# Altium project iSystem.PrjPcb
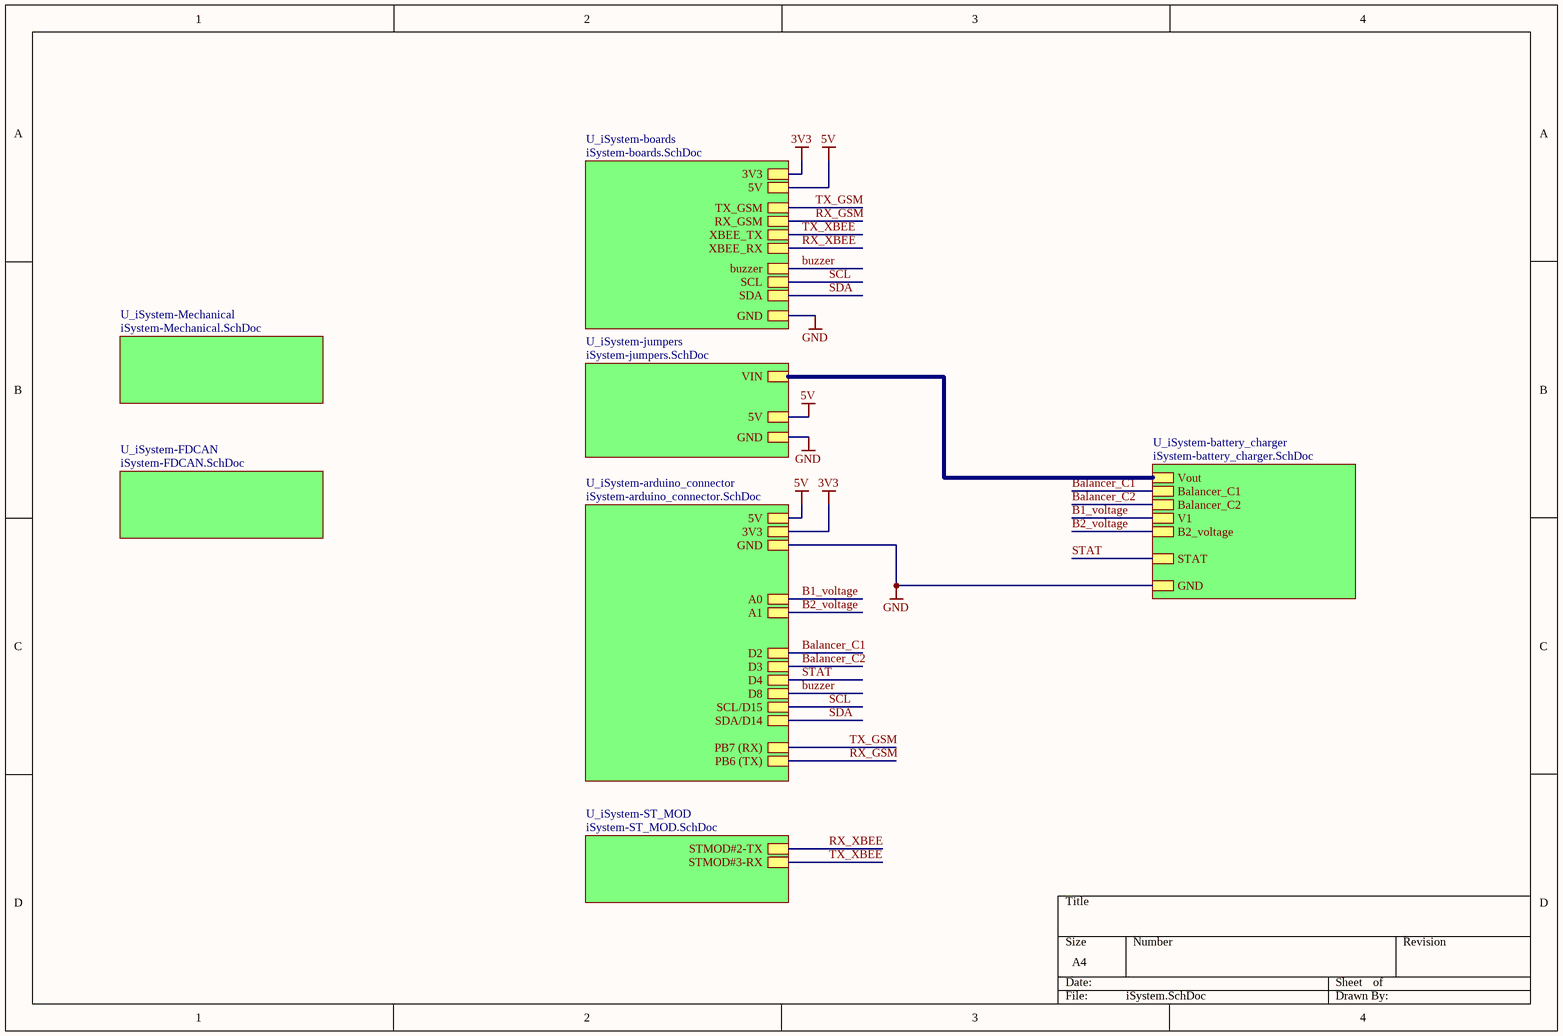
[diagram p0: iSystem.SchDoc]
8 sheets, 82 parts. Net scope: hierarchical (ports join the sheet entries above them; power ports are global).
Board file: iSystem.PcbDoc
Sheets:
  iSystem.SchDoc
    U_iSystem-Mechanical = iSystem-Mechanical.SchDoc
    U_iSystem-FDCAN = iSystem-FDCAN.SchDoc
    U_iSystem-boards = iSystem-boards.SchDoc
    U_iSystem-jumpers = iSystem-jumpers.SchDoc
    U_iSystem-arduino_connector = iSystem-arduino_connector.SchDoc
    U_iSystem-ST_MOD = iSystem-ST_MOD.SchDoc
    U_iSystem-battery_charger = iSystem-battery_charger.SchDoc

## Sheet iSystem.SchDoc
size A4; SheetNumber: 1; SheetTotal: 8

### Sub-sheets
U_iSystem-arduino_connector = iSystem-arduino_connector.SchDoc: 3V3, 5V, GND, A0, A1, PB7 (RX), PB6 (TX), D2, D3, D4, D8, SCL/D15, SDA/D14
U_iSystem-battery_charger = iSystem-battery_charger.SchDoc: Vout, Balancer_C1, Balancer_C2, V1, GND, STAT, B2_voltage
U_iSystem-boards = iSystem-boards.SchDoc: 3V3, 5V, GND, TX_GSM, RX_GSM, buzzer, XBEE_TX, XBEE_RX, SCL, SDA
U_iSystem-FDCAN = iSystem-FDCAN.SchDoc: no entries
U_iSystem-jumpers = iSystem-jumpers.SchDoc: 5V, GND, VIN
U_iSystem-Mechanical = iSystem-Mechanical.SchDoc: no entries
U_iSystem-ST_MOD = iSystem-ST_MOD.SchDoc: STMOD#2-TX, STMOD#3-RX

### Nets
3V3: sheet U_iSystem-boards/3V3, sheet U_iSystem-arduino_connector/3V3
5V: sheet U_iSystem-boards/5V, sheet U_iSystem-jumpers/5V, sheet U_iSystem-arduino_connector/5V
GND: sheet U_iSystem-boards/GND, sheet U_iSystem-jumpers/GND, sheet U_iSystem-arduino_connector/GND, sheet U_iSystem-battery_charger/GND
B1_voltage: sheet U_iSystem-arduino_connector/A0, sheet U_iSystem-battery_charger/V1
B2_voltage: sheet U_iSystem-arduino_connector/A1, sheet U_iSystem-battery_charger/B2_voltage
Balancer_C1: sheet U_iSystem-arduino_connector/D2, sheet U_iSystem-battery_charger/Balancer_C1
Balancer_C2: sheet U_iSystem-arduino_connector/D3, sheet U_iSystem-battery_charger/Balancer_C2
BAT1+: sheet U_iSystem-jumpers/VIN, sheet U_iSystem-battery_charger/Vout
buzzer: sheet U_iSystem-boards/buzzer, sheet U_iSystem-arduino_connector/D8
RX_GSM: sheet U_iSystem-boards/RX_GSM, sheet U_iSystem-arduino_connector/PB6 (TX)
RX_XBEE: sheet U_iSystem-boards/XBEE_RX, sheet U_iSystem-ST_MOD/STMOD#2-TX
SCL: sheet U_iSystem-boards/SCL, sheet U_iSystem-arduino_connector/SCL/D15
SDA: sheet U_iSystem-boards/SDA, sheet U_iSystem-arduino_connector/SDA/D14
STAT: sheet U_iSystem-arduino_connector/D4, sheet U_iSystem-battery_charger/STAT
TX_GSM: sheet U_iSystem-boards/TX_GSM, sheet U_iSystem-arduino_connector/PB7 (RX)
TX_XBEE: sheet U_iSystem-boards/XBEE_TX, sheet U_iSystem-ST_MOD/STMOD#3-RX

## Sheet iSystem-Mechanical.SchDoc
size A4; SheetNumber: 8; SheetTotal: 8
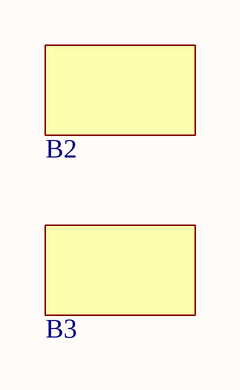
[diagram p1: iSystem-Mechanical.SchDoc]

### Parts
B2  BAT  [BAT]  (value not drawn)
B3  BAT  [BAT]  (value not drawn)

## Sheet iSystem-FDCAN.SchDoc
size A4; SheetNumber: 6; SheetTotal: 8
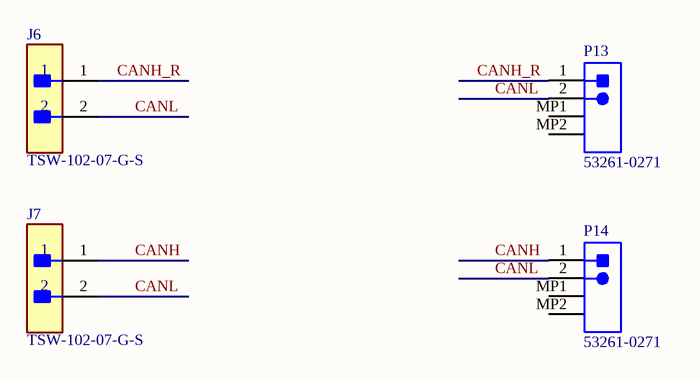
[diagram p2: iSystem-FDCAN.SchDoc]

### Parts
J6  TSW-102-07-G-S  [FP-TSW-102-07-G-S-MFG]
J7  TSW-102-07-G-S  [FP-TSW-102-07-G-S-MFG]
P13  53261-0271  [MOLX-53261-0271_V]
P14  53261-0271  [MOLX-53261-0271_V]

### Nets
CANH: J7.1 P14.1
CANH_R: J6.1 P13.1
CANL: J6.2 J7.2 P13.2 P14.2

Not connected (* = marked no-connect by the designer): P13 MP1 MP2; P14 MP1 MP2

### Library data of the parts
J6 J7 = CMP-02766-000084-1: CONN HEADER VERT 2POS 2.54MM; Manufacturer: Samtec; Number Of Contacts: 2; Voltage Rating: 550V; Conn Orientation: Straight; Current Rating: 6.3A; Conn Gender: Male; Package: TSW-102-07-G-S; Digikey Description: CONN HEADER VERT 2POS 2.54MM; ComponentLink2URL: http://suddendocs.samtec.com/catalog_english/tsw_th.pdf; Height: 8.71mm; Temperature: -55°C to +125°C; Device Class L2: Headers and Wire Housings; ComponentLink2Description: Datasheet; Device Class L3: unset; Contact Material: Gold,Nickel; Temperature Range Low: -55°C; Temperature Range High: +125°C; RoHS: TRUE; Device Class L1: Connectors; Mouser Description: Conn Unshrouded Header HDR 2 POS 2.54mm Solder ST Thru-Hole Automotive Bulk; Number Of Rows: 1; Category: Conn; Pitch: 2.54mm; Lead Free: Yes; Automotive: No; Manufacturer Part Number: TSW-102-07-G-S; Footprint Url: http://suddendocs.samtec.com/prints/tsw-xxx-xx-x-x-xx-xxx-footprint.pdf; Octopart: https://octopart.com/tsw-102-07-g-s-samtec-272197
P13 P14 = CMP-2000-05633-1: PicoBlade(TM) Header, Right Angle, -40 to 85 degC, 2-Pin SMD, RoHS, Tape and Reel; Current - Max: 1A; Brand: Molex; Voltage Rating: 125V; Number of Positions: 2; Pitch: 1.25mm; Package Version: Rev. H, 11/2014; Factory Pack Quantity: 1000; Datasheet URL: http://www.molex.com/webdocs/datasheets/pdf/en-us/0532610271_PCB_HEADERS.pdf; Datasheet Version: 03/2016; Housing Material: Thermoplastic; RoHS: Details; Product Type: Headers; Number of Rows: 1; Termination Style: SMD; Mounting Technology: SurfaceMount; Number of Positions / Contacts: 2; Package URL: http://www.molex.com/pdm_docs/sd/532610271_sd.pdf; Mounting Angle: Right; Mounting Style: SMD/SMT; Manufacturer: Molex; Product Category: 1.25mmConnectors; Tradename: PicoBlade; Voltage - Max: 125V; Manufacturer URL: http://www.molex.com/; Series: 53261; Package Description: 2-Leads Header, Pitch 1.25 mm, Mated Height 3.4 mm; Package Reference: 53261-0271; Current Rating: 1A; Contact Plating: Tin; Contact Material: PhosphorBronze; Type: Shrouded; Packaging: Reel

## Sheet iSystem-boards.SchDoc
size A4; SheetNumber: 7; SheetTotal: 8
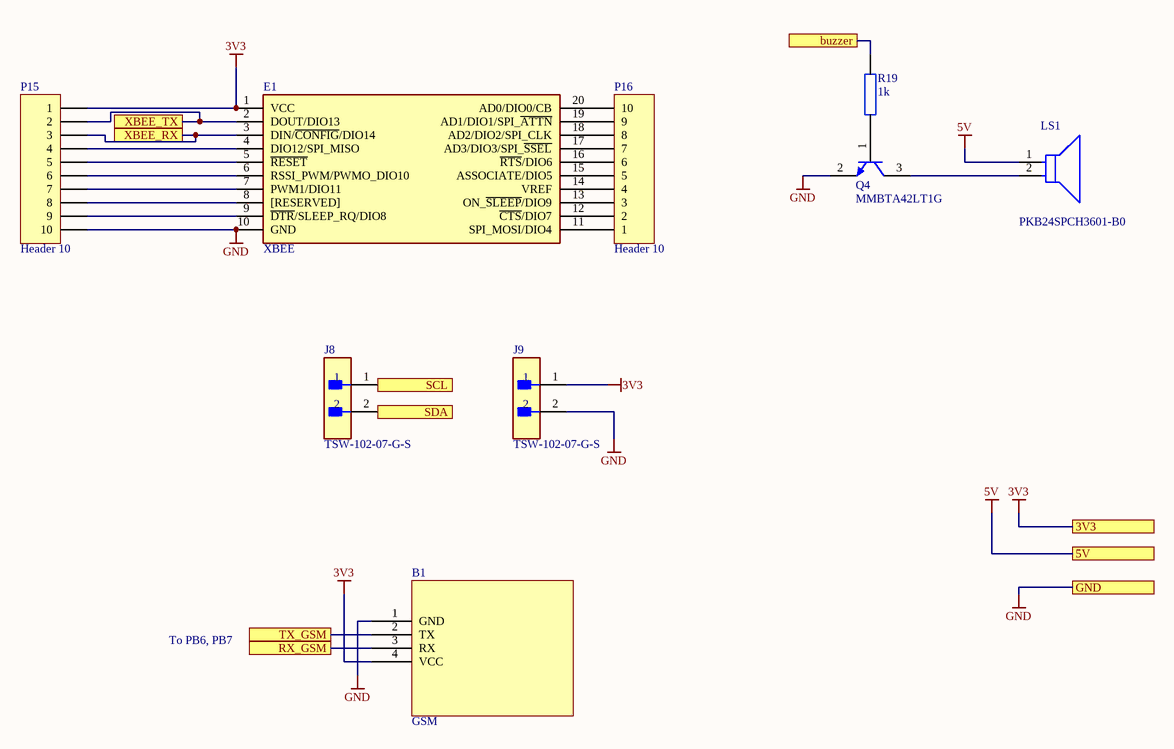
[diagram p3: iSystem-boards.SchDoc]

### Parts
B1  GSM  [GSM]
E1  XBEE  [XBEE]
J8  TSW-102-07-G-S  [FP-TSW-102-07-G-S-MFG]
J9  TSW-102-07-G-S  [FP-TSW-102-07-G-S-MFG]
LS1  PKB24SPCH3601-B0  [FP-PKB24SPCH3601-B0-MFG]
P15  Header 10  [HDR1X10]
P16  Header 10  [HDR1X10]
Q4  MMBTA42LT1G  [ONSC-SOT-23-3-318-08_V]
R19  1k  [0603]

### Ports
3V3, 5V, buzzer, GND, RX_GSM, SCL, SDA, TX_GSM, XBEE_RX, XBEE_TX

### Nets
3V3: B1.4(VCC) E1.1(VCC) J9.1 P15.1 ; port 3V3
5V: LS1.1(C) ; port 5V
GND: B1.1(GND) E1.10(GND) J9.2 P15.10 Q4.2(E) ; port GND
buzzer: R19.2 ; port buzzer
RX_GSM: B1.3(RX) ; port RX_GSM
RX_XBEE: E1.3(DIN/~{CONFIG}/DIO14) P15.3 ; port XBEE_RX
SCL: J8.1 ; port SCL
SDA: J8.2 ; port SDA
TX_GSM: B1.2(TX) ; port TX_GSM
TX_XBEE: E1.2(DOUT/DIO13) P15.2 ; port XBEE_TX
NetE1_4: E1.4(DIO12/SPI_MISO) P15.4
NetE1_5: E1.5(~{RESET}) P15.5
NetE1_6: E1.6(RSSI_PWM/PWMO_DIO10) P15.6
NetE1_7: E1.7(PWM1/DIO11) P15.7
NetE1_8: E1.8([RESERVED]) P15.8
NetE1_9: E1.9(~{DTR}/SLEEP_RQ/DIO8) P15.9
NetE1_11: E1.11(SPI_MOSI/DIO4) P16.1
NetE1_12: E1.12(~{CTS}/DIO7) P16.2
NetE1_13: E1.13(ON_~{SLEEP}/DIO9) P16.3
NetE1_14: E1.14(VREF) P16.4
NetE1_15: E1.15(ASSOCIATE/DIO5) P16.5
NetE1_16: E1.16(~{RTS}/DIO6) P16.6
NetE1_17: E1.17(AD3/DIO3/SPI_~{SSEL}) P16.7
NetE1_18: E1.18(AD2/DIO2/SPI_CLK) P16.8
NetE1_19: E1.19(AD1/DIO1/SPI_~{ATTN}) P16.9
NetE1_20: E1.20(AD0/DIO0/CB) P16.10
NetLS1_2: LS1.2(A) Q4.3(C)
NetQ4_1: Q4.1(B) R19.1

### Notes on the sheet
- To PB6, PB7

### Library data of the parts
B1 = GSM: 3V3
J8 J9 = CMP-02766-000084-1: as J6 on sheet iSystem-FDCAN; Package: TSW-102-07-G-S; Digikey Description: CONN HEADER VERT 2POS 2.54MM; ComponentLink2URL: http://suddendocs.samtec.com/catalog_english/tsw_th.pdf; Height: 8.71mm; Temperature: -55°C to +125°C; Device Class L2: Headers and Wire Housings; ComponentLink2Description: Datasheet; Device Class L3: unset; Contact Material: Gold,Nickel; Temperature Range Low: -55°C; Temperature Range High: +125°C; RoHS: TRUE; Device Class L1: Connectors; Mouser Description: Conn Unshrouded Header HDR 2 POS 2.54mm Solder ST Thru-Hole Automotive Bulk; Number Of Rows: 1; Category: Conn; Pitch: 2.54mm; Lead Free: Yes; Automotive: No; Manufacturer Part Number: TSW-102-07-G-S; Footprint Url: http://suddendocs.samtec.com/prints/tsw-xxx-xx-x-x-xx-xxx-footprint.pdf; Octopart: https://octopart.com/tsw-102-07-g-s-samtec-272197
LS1 = CMP-06203-000001-2: AUDIO PIEZO TRANSDUCER 3-15V TH; Self Resonant Frequency: 3.6kHz; Voltage Rating (DC): 15V; Min Supply Voltage: 3V; Operating Supply Current: 16mA; Voltage Rating: 12V; Max Frequency: 4.1kHz; Washable: No; REACH SVHC: No SVHC; Packaging: Bulk; Frequency: 3.6kHz; Max Operating Temperature: 70°C; Max Supply Voltage: 15V; Max Supply Voltage (DC): 15V; Diameter: 24.3mm; Lead Free: Lead Free; Radiation Hardening: No; Nominal Supply Current: 16mA; Height: 9.7mm; Mount: Flush; Nominal Supply Voltage (DC): 12V; Min Operating Temperature: -20°C; Termination: PC Pins; Length: 24.3mm; Package Quantity: 650; Min Supply Voltage (DC): 3V; Max Supply Current: 16mA
P15 P16 = Header 10: Header, 10-Pin; LatestRevisionDate: 17-Jul-2002; LatestRevisionNote: Re-released for DXP Platform.; Publisher: Altium Limited
Q4 = CMP-1048-00662-1: High Voltage Transistor, NPN Silicon, 3-Pin SOT-23, Pb-Free, Tape and Reel; Manufacturer: On Semiconductor; fT Min (MHz): 50; IC Continuous (A): 0.5; ComponentLink1URL: http://www.onsemi.com/; ComponentLink3URL: http://www.onsemi.cn/pub_link/Collateral/318-08.PDF; RoHS: TRUE; ComponentLink2Description: Datasheet; PartNumber: MMBTA42LT1G; Polarity: NPN; DatasheetVersion: Rev. 12; PackageReference: SOT-23-3-318-08; PackageDescription: 3-Pin Small Outline Transistor, Body 2.92 x 1.3 mm, Pitch 0.95 mm; ComponentLink3Description: Package Specification; ComponentLink1Description: Manufacturer URL; Packing: Tape and Reel; PackageVersion: Rev. AP, 11/2009; Mounting Technology: Surface Mount; ComponentLink2URL: http://www.onsemi.cn/pub_link/Collateral/MMBTA42LT1-D.PDF
R19 = Resistor: Value: ?

## Sheet iSystem-jumpers.SchDoc
size A4; SheetNumber: 3; SheetTotal: 8
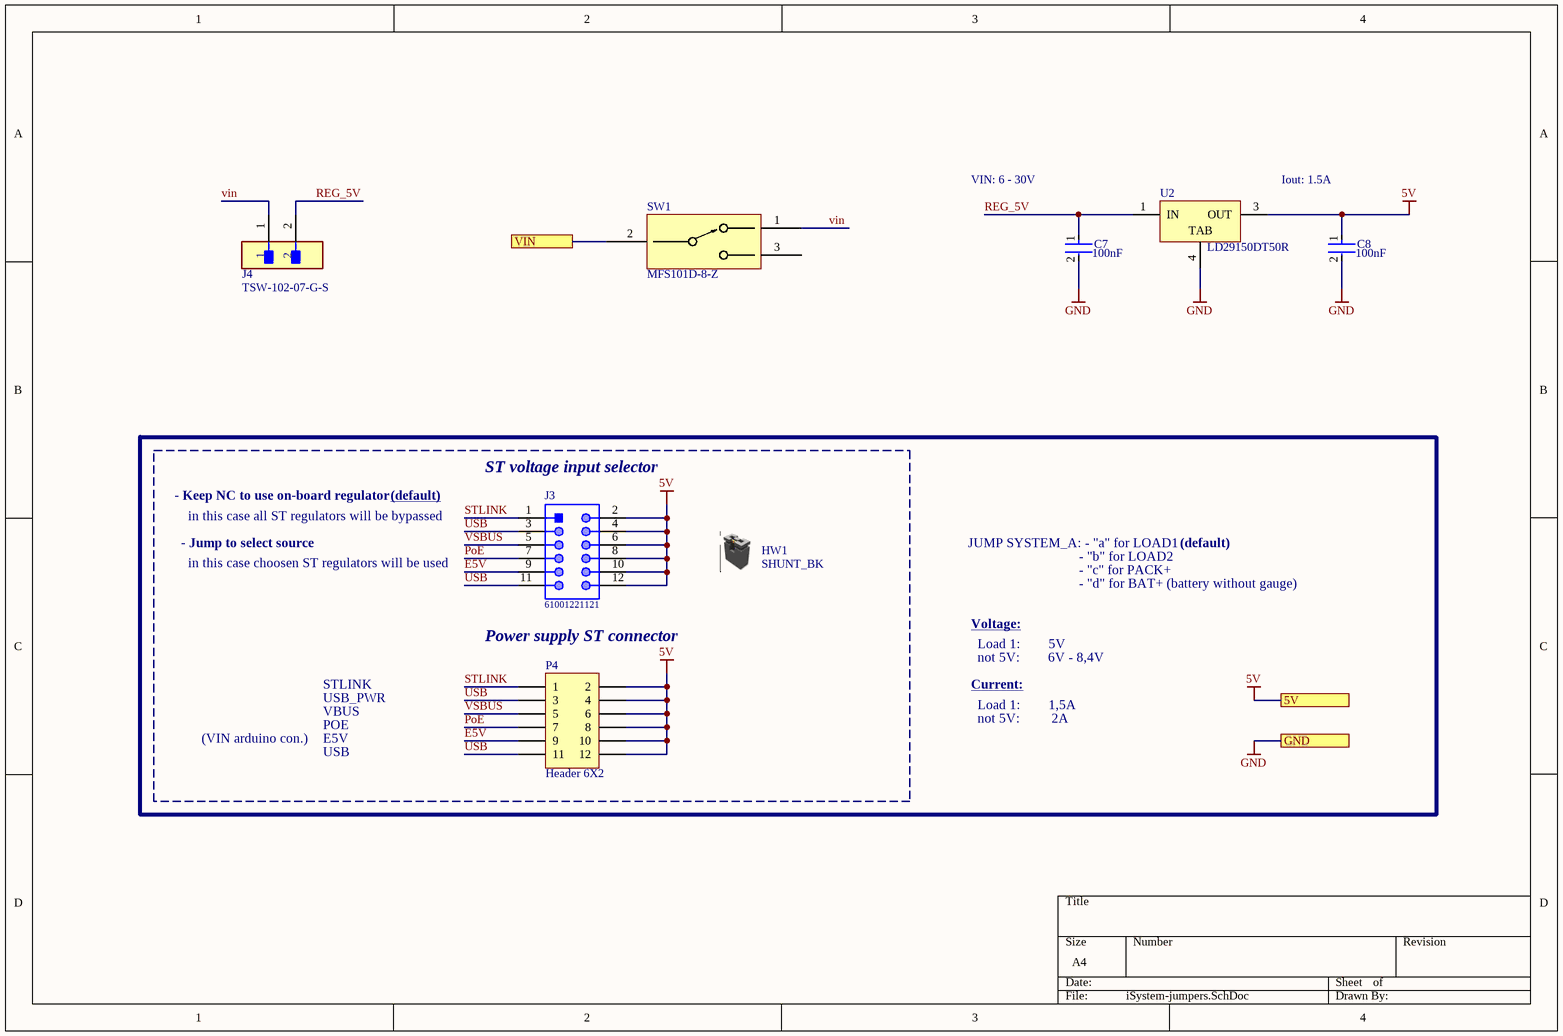
[diagram p4: iSystem-jumpers.SchDoc]

### Parts
C7  100nF  [FP-CGA3E-0_3-0_1-IPC_A]
C8  100nF  [FP-CGA3E-0_3-0_1-IPC_A]
HW1  value SHUNT_BK  [NA]  (hidden comment: Shunt Black 2.54mm)  (mechanical)
J3  61001221121  [61001221121]
J4  TSW-102-07-G-S  [FP-TSW-102-07-G-S-MFG]
P4  Header 6X2  [HDR2X6]
SW1  MFS101D-8-Z  [MFS101D-8-Z]
U2  LD29150DT50R  [TO-252_M]

### Ports
5V, GND, VIN

### Nets
5V: C8.1 J3.2 J3.4 J3.6 J3.8 J3.10 J3.12 P4.2 P4.4 P4.6 P4.8 P4.10 P4.12 U2.3(OUT) ; port 5V
GND: C7.2 C8.2 U2.4(TAB) ; port GND
BAT1+: SW1.2 ; port VIN
E5V: J3.9 P4.9
PoE: J3.7 P4.7
REG_5V: C7.1 J4.2 U2.1(IN)
STLINK: J3.1 P4.1
USB: J3.3 J3.11 P4.3 P4.11
vin: J4.1 SW1.1
VSBUS: J3.5 P4.5

Not connected (* = marked no-connect by the designer): SW1 3

### Notes on the sheet
- VIN: 6 - 30V
- Iout: 1.5A
- - Keep NC to use on-board regulator
- (near J3) in this case all ST regulators will be bypassed
- (default)
- ST voltage input selector
- - Jump to select source
- (near J3) in this case choosen ST regulators will be used
- JUMP SYSTEM_A: - "a" for LOAD1
- - "b" for LOAD2
- - "c" for PACK+
- Power supply ST connector
- Voltage:
- Load 1:        5V
- - "d" for BAT+ (battery without gauge)
- STLINK
- USB_PWR
- VBUS
- Current:
- not 5V:        6V - 8,4V
- Load 1:        1,5A
- (VIN arduino con.)
- POE
- E5V
- USB
- not 5V:         2A

### Library data of the parts
C7 C8 = CMP-2000-07546-2: Cap Ceramic 100nF 50V X7R 10% Pad SMD 0603 +125°C Automotive T/R; Weight: 7.1E-05oz; Composition: Ceramic; Max Operating Temperature: 125°C; Termination: SMD/SMT; Dielectric: X7R; Length: 1.6mm; Package Quantity: 1; REACH SVHC: No SVHC; Lead Free: Lead Free; Case Code (Metric): 1608; Min Operating Temperature: -55°C; Packaging: Tape and Reel; Tolerance: 10%; Voltage Rating: 50V; Case Code (Imperial): 0603; Capacitance: 100nF; Case/Package: 0603; Voltage Rating (DC): 50V; Depth: 0.8mm; Radiation Hardening: No; Ratings: AEC-Q200; Mount: Surface Mount; Voltage: 50V; Thickness: 0.035inch; Width: 0.8mm; Height: 0.8mm
HW1 = MCD-00122: SHUNT, 2.54mm, height 6.10mm, BLACK; Manufacturer_Part_Number: SNT-100-BK-G; Manufacturer: SAMTEC; Part_Type: Connector; ECCN_US: EAR99; ECCN_EU: NEC; Provided_By: Subcon; Initial_Board_Reference: mb1262; Internal_Part_Number: MCD-00122; Status: Released; ComponentLink1Description: Samtec_Shunt_Jumper_SNT100.pdf; ComponentLink1URL: http://tunmcdsvn.tun.st.com/Component_Datasheet_Library/Trunk/Connectors/Samtec_Shunt_Jumper_SNT100.pdf
J3 = CMP-1502-01029-1: SMT Vertical Pin Header WR-PHD, Pitch 2.54 mm, Dual Row, 12 pins; Manufacturer: Wurth Elektronik; Working Voltage: 250VAC; Pin Number: 12; Withstanding Voltage: 500VAC; Contact Resistance: 20mOhm; Rated Current: 3A; Gender: Male; Pitch: 2.54mm; Publisher: WurthElektronik; Packaging: Tube; Part Number: 61001221121; Row Number: Dual; Mounting Technology: SMT; Manufacturer URL: http://www.we-online.de; Operating Temperature: -40to125degC; Datasheet URL: https://katalog.we-online.de/em/datasheet/6100xx21121.pdf; Orientation: Vertical; Package Reference: 61001221121
J4 = CMP-02766-000084-1: as J6 on sheet iSystem-FDCAN; Package: TSW-102-07-G-S; Digikey Description: CONN HEADER VERT 2POS 2.54MM; ComponentLink2URL: http://suddendocs.samtec.com/catalog_english/tsw_th.pdf; Height: 8.71mm; Temperature: -55°C to +125°C; Device Class L2: Headers and Wire Housings; ComponentLink2Description: Datasheet; Device Class L3: unset; Contact Material: Gold,Nickel; Temperature Range Low: -55°C; Temperature Range High: +125°C; RoHS: TRUE; Device Class L1: Connectors; Mouser Description: Conn Unshrouded Header HDR 2 POS 2.54mm Solder ST Thru-Hole Automotive Bulk; Number Of Rows: 1; Category: Conn; Pitch: 2.54mm; Lead Free: Yes; Automotive: No; Manufacturer Part Number: TSW-102-07-G-S; Footprint Url: http://suddendocs.samtec.com/prints/tsw-xxx-xx-x-x-xx-xxx-footprint.pdf; Octopart: https://octopart.com/tsw-102-07-g-s-samtec-272197
P4 = Header 6X2: Header, 6-Pin, Dual row; LatestRevisionDate: 17-Jul-2002; LatestRevisionNote: Re-released for DXP Platform.; Publisher: Altium Limited
U2 = CMP-0244-00134-1: 1.5A, Very-Low Drop Voltage Regulator, 5V, 3-Pin DPAK; PackageDescription: 3-Pin Transistor Outline Package 2.28 mm Pitch, 9.7 mm Lead Span (DPAK); ComponentLink1URL: http://www.st.com; PackageVersion: 2011; ComponentLink1Description: Manufacturer URL; DatasheetVersion: 27/10/2010; ComponentLink2URL: http://www.st.com/internet/com/TECHNICAL_RESOURCES/TECHNICAL_LITERATURE/DATASHEET/CD00003403.pdf; PackageReference: TO-252; ComponentLink2Description: Datasheet

## Sheet iSystem-arduino_connector.SchDoc
size A4; SheetNumber: 4; SheetTotal: 8
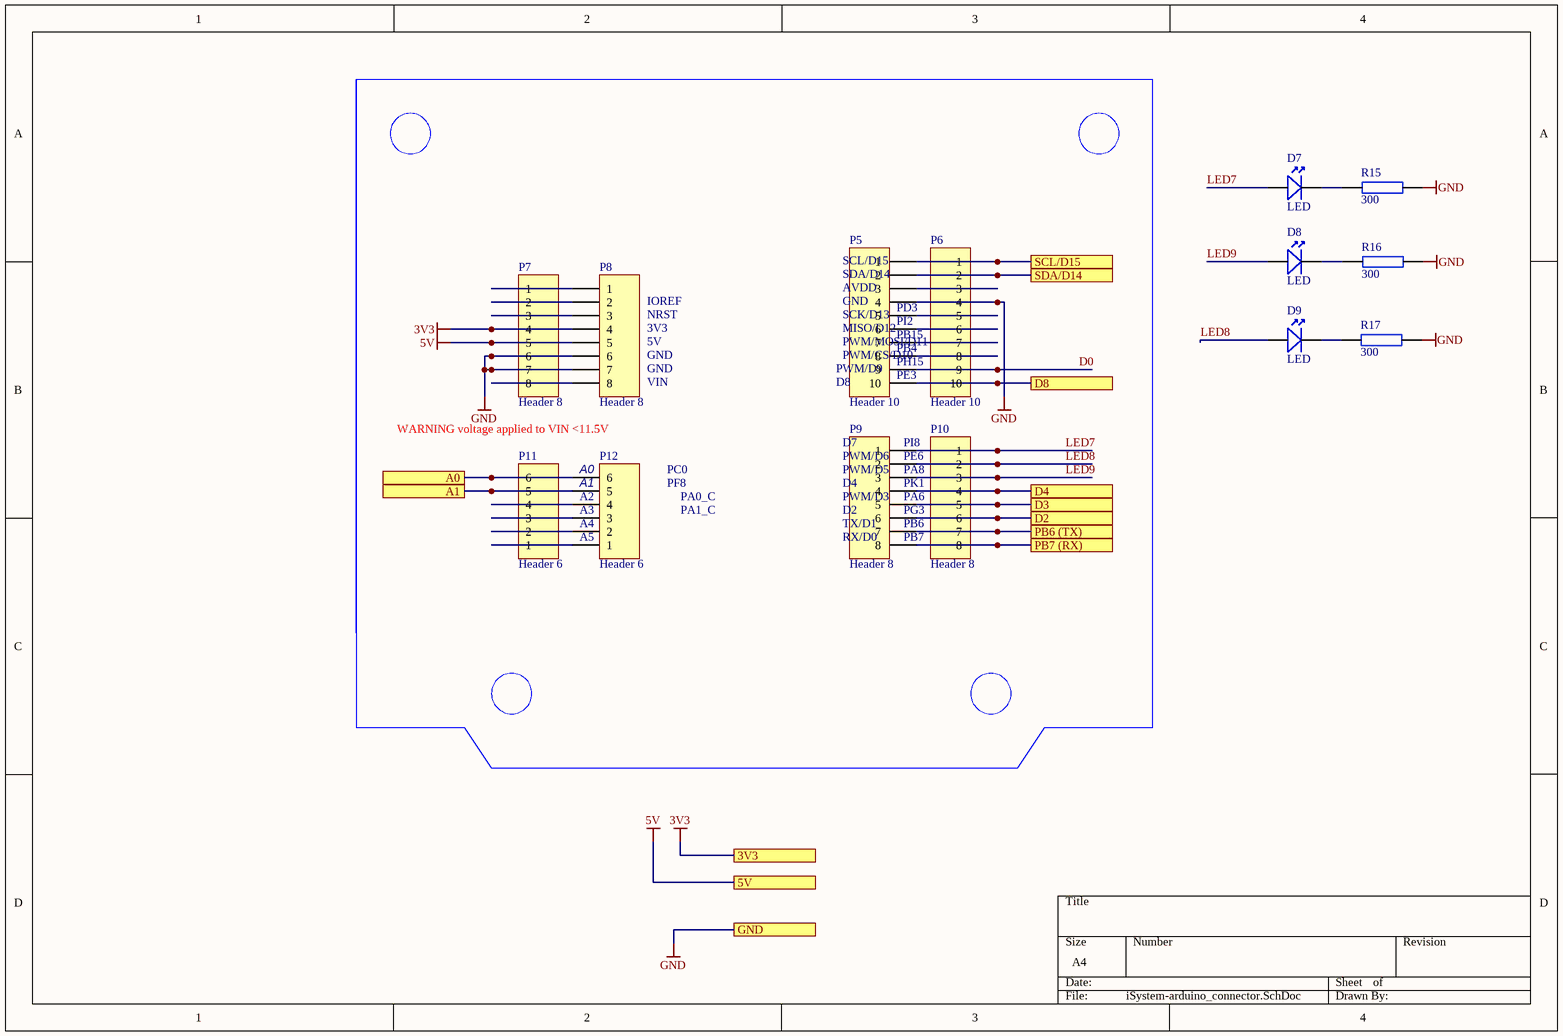
[diagram p5: iSystem-arduino_connector.SchDoc]

### Parts
D7  LED  [0805 LED RED]
D8  LED  [0805 LED RED]
D9  LED  [0805 LED RED]
P5  Header 10  [HDR1X10]
P6  Header 10  [HDR1X10]
P7  Header 8  [HDR1X8]
P8  Header 8  [HDR1X8]
P9  Header 8  [HDR1X8]
P10  Header 8  [HDR1X8]
P11  Header 6  [HDR1X6]
P12  Header 6  [HDR1X6]
R15  300  [0603]
R16  300  [0603]
R17  300  [0603]

### Ports
3V3, 5V, A0, A1, D2, D3, D4, D8, GND, PB6 (TX), PB7 (RX), SCL/D15, SDA/D14

### Nets
3V3: P7.4 P8.4 ; port 3V3
5V: P7.5 P8.5 ; port 5V
GND: P5.4 P6.4 P7.6 P7.7 P8.6 P8.7 R15.1 R16.1 R17.1 ; port GND
B1_voltage: P11.6 P12.6 ; port A0
B2_voltage: P11.5 P12.5 ; port A1
Balancer_C1: P9.6 P10.6 ; port D2
Balancer_C2: P9.5 P10.5 ; port D3
buzzer: P5.10 P6.10 ; port D8
D0: P5.9 P6.9
LED7: D7.1(A) P9.1 P10.1
LED8: D9.1(A) P9.2 P10.2
LED9: D8.1(A) P9.3 P10.3
RX_GSM: P9.7 P10.7 ; port PB6 (TX)
SCL: P5.1 P6.1 ; port SCL/D15
SDA: P5.2 P6.2 ; port SDA/D14
STAT: P9.4 P10.4 ; port D4
TX_GSM: P9.8 P10.8 ; port PB7 (RX)
NetD7_2: D7.2(K) R15.2
NetD8_2: D8.2(K) R16.2
NetD9_2: D9.2(K) R17.2
NetP5_3: P5.3 P6.3
NetP5_5: P5.5 P6.5
NetP5_6: P5.6 P6.6
NetP5_7: P5.7 P6.7
NetP5_8: P5.8 P6.8
NetP7_1: P7.1 P8.1
NetP7_2: P7.2 P8.2
NetP7_3: P7.3 P8.3
NetP7_8: P7.8 P8.8
NetP11_1: P11.1 P12.1
NetP11_2: P11.2 P12.2
NetP11_3: P11.3 P12.3
NetP11_4: P11.4 P12.4

### Notes on the sheet
- (near P8) IOREF
- (near P5) SDA/D14
- (near P5) SCL/D15
- (near P5) AVDD
- (near P5) GND
- (near P5) PD3
- (near P8) NRST
- (near P8) 3V3
- (near P8) 5V
- (near P8) GND
- (near P8) VIN
- D8
- PWM/D9
- (near P5) PWM/CS/D10
- (near P5) SCK/D13
- (near P5) MISO/D12
- (near P5) PWM/MOSI/D11
- (near P5) PE3
- (near P5) PB4
- (near P5) PH15
- (near P5) PB15
- (near P5) PI2
- WARNING voltage applied to VIN <11.5V
- D7
- (near P9) PI8
- (near P12) A0
- (near P12) A1
- (near P12) A2
- (near P12) A3
- (near P12) PC0
- (near P12) PF8
- (near P12) PA0_C
- (near P12) PA1_C
- (near P9) D2
- (near P9) D4
- (near P9) PWM/D3
- (near P9) PWM/D5
- (near P9) PWM/D6
- (near P9) PG3
- (near P9) PK1
- (near P9) PA8
- (near P9) PE6
- (near P9) PA6
- (near P12) A4
- (near P12) A5
- (near P9) RX/D0
- (near P9) TX/D1
- (near P9) PB6
- (near P9) PB7

### Library data of the parts
P5 P6 = Header 10: Header, 10-Pin; LatestRevisionDate: 17-Jul-2002; LatestRevisionNote: Re-released for DXP Platform.; Publisher: Altium Limited
P7-P10 = Header 8: Header, 8-Pin; LatestRevisionDate: 17-Jul-2002; LatestRevisionNote: Re-released for DXP Platform.; Publisher: Altium Limited
P11 P12 = Header 6: Header, 6-Pin; LatestRevisionDate: 17-Jul-2002; LatestRevisionNote: Re-released for DXP Platform.; Publisher: Altium Limited
R15-R17 = Resistor: Value: ?

## Sheet iSystem-ST_MOD.SchDoc
size A4; SheetNumber: 5; SheetTotal: 8
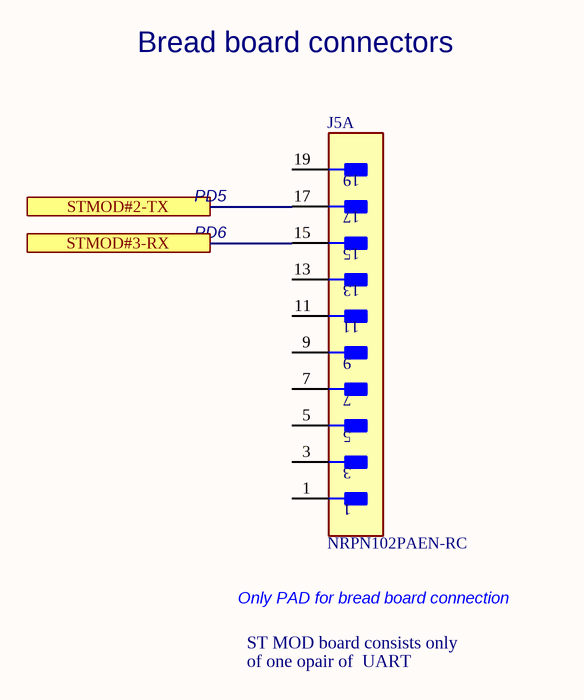
[diagram p6: iSystem-ST_MOD.SchDoc]

### Parts
J5  NRPN102PAEN-RC  [FP-NRPN102PAEN-RC-MFG]  (part A of 2)

### Ports
STMOD#2-TX, STMOD#3-RX

### Nets
RX_XBEE: J5.17 ; port STMOD#2-TX
TX_XBEE: J5.15 ; port STMOD#3-RX

Not connected (* = marked no-connect by the designer): J5 1 3 5 7 9 11 13 19

### Notes on the sheet
- Bread board connectors
- PD5
- PD6
- Only PAD for bread board connection
- ST MOD board consists only
- of one opair of  UART

### Library data of the parts
J5 = CMP-25680-000023-1: CONN HEADER VERT 20POS 2MM; Manufacturer: Sullins; Current Rating: 2A; Voltage Rating: 150V; Number Of Contacts: 20; Conn Gender: Male; Conn Orientation: Straight; RoHS: TRUE; Temperature: -40°C to +105°C; Pitch: 2mm; Footprint Url: https://drawings-pdf.s3.amazonaws.com/10637.pdf; Lead Free: Yes; Height: 5.95mm; Package: 0; ComponentLink2URL: https://s3.amazonaws.com/catalogspreads-pdf/PAGE104-105%202mm%20MALE%20HDR%20ST%20RA%20SMT.pdf; Device Class L1: Connectors; Digikey Description: CONN HEADER VERT 20POS 2MM; Device Class L2: Headers and Wire Housings; Temperature Range High: +105°C; Temperature Range Low: -40°C; Number Of Rows: 2; Category: Conn; Automotive: No; Device Class L3: unset; ComponentLink2Description: Datasheet; Manufacturer Part Number: NRPN102PAEN-RC; Contact Material: Gold; Octopart: https://octopart.com/nrpn102paen-rc-sullins-12086181

## Sheet iSystem-battery_charger.SchDoc
size 420 x 297 mm; SheetNumber: 2; SheetTotal: 8
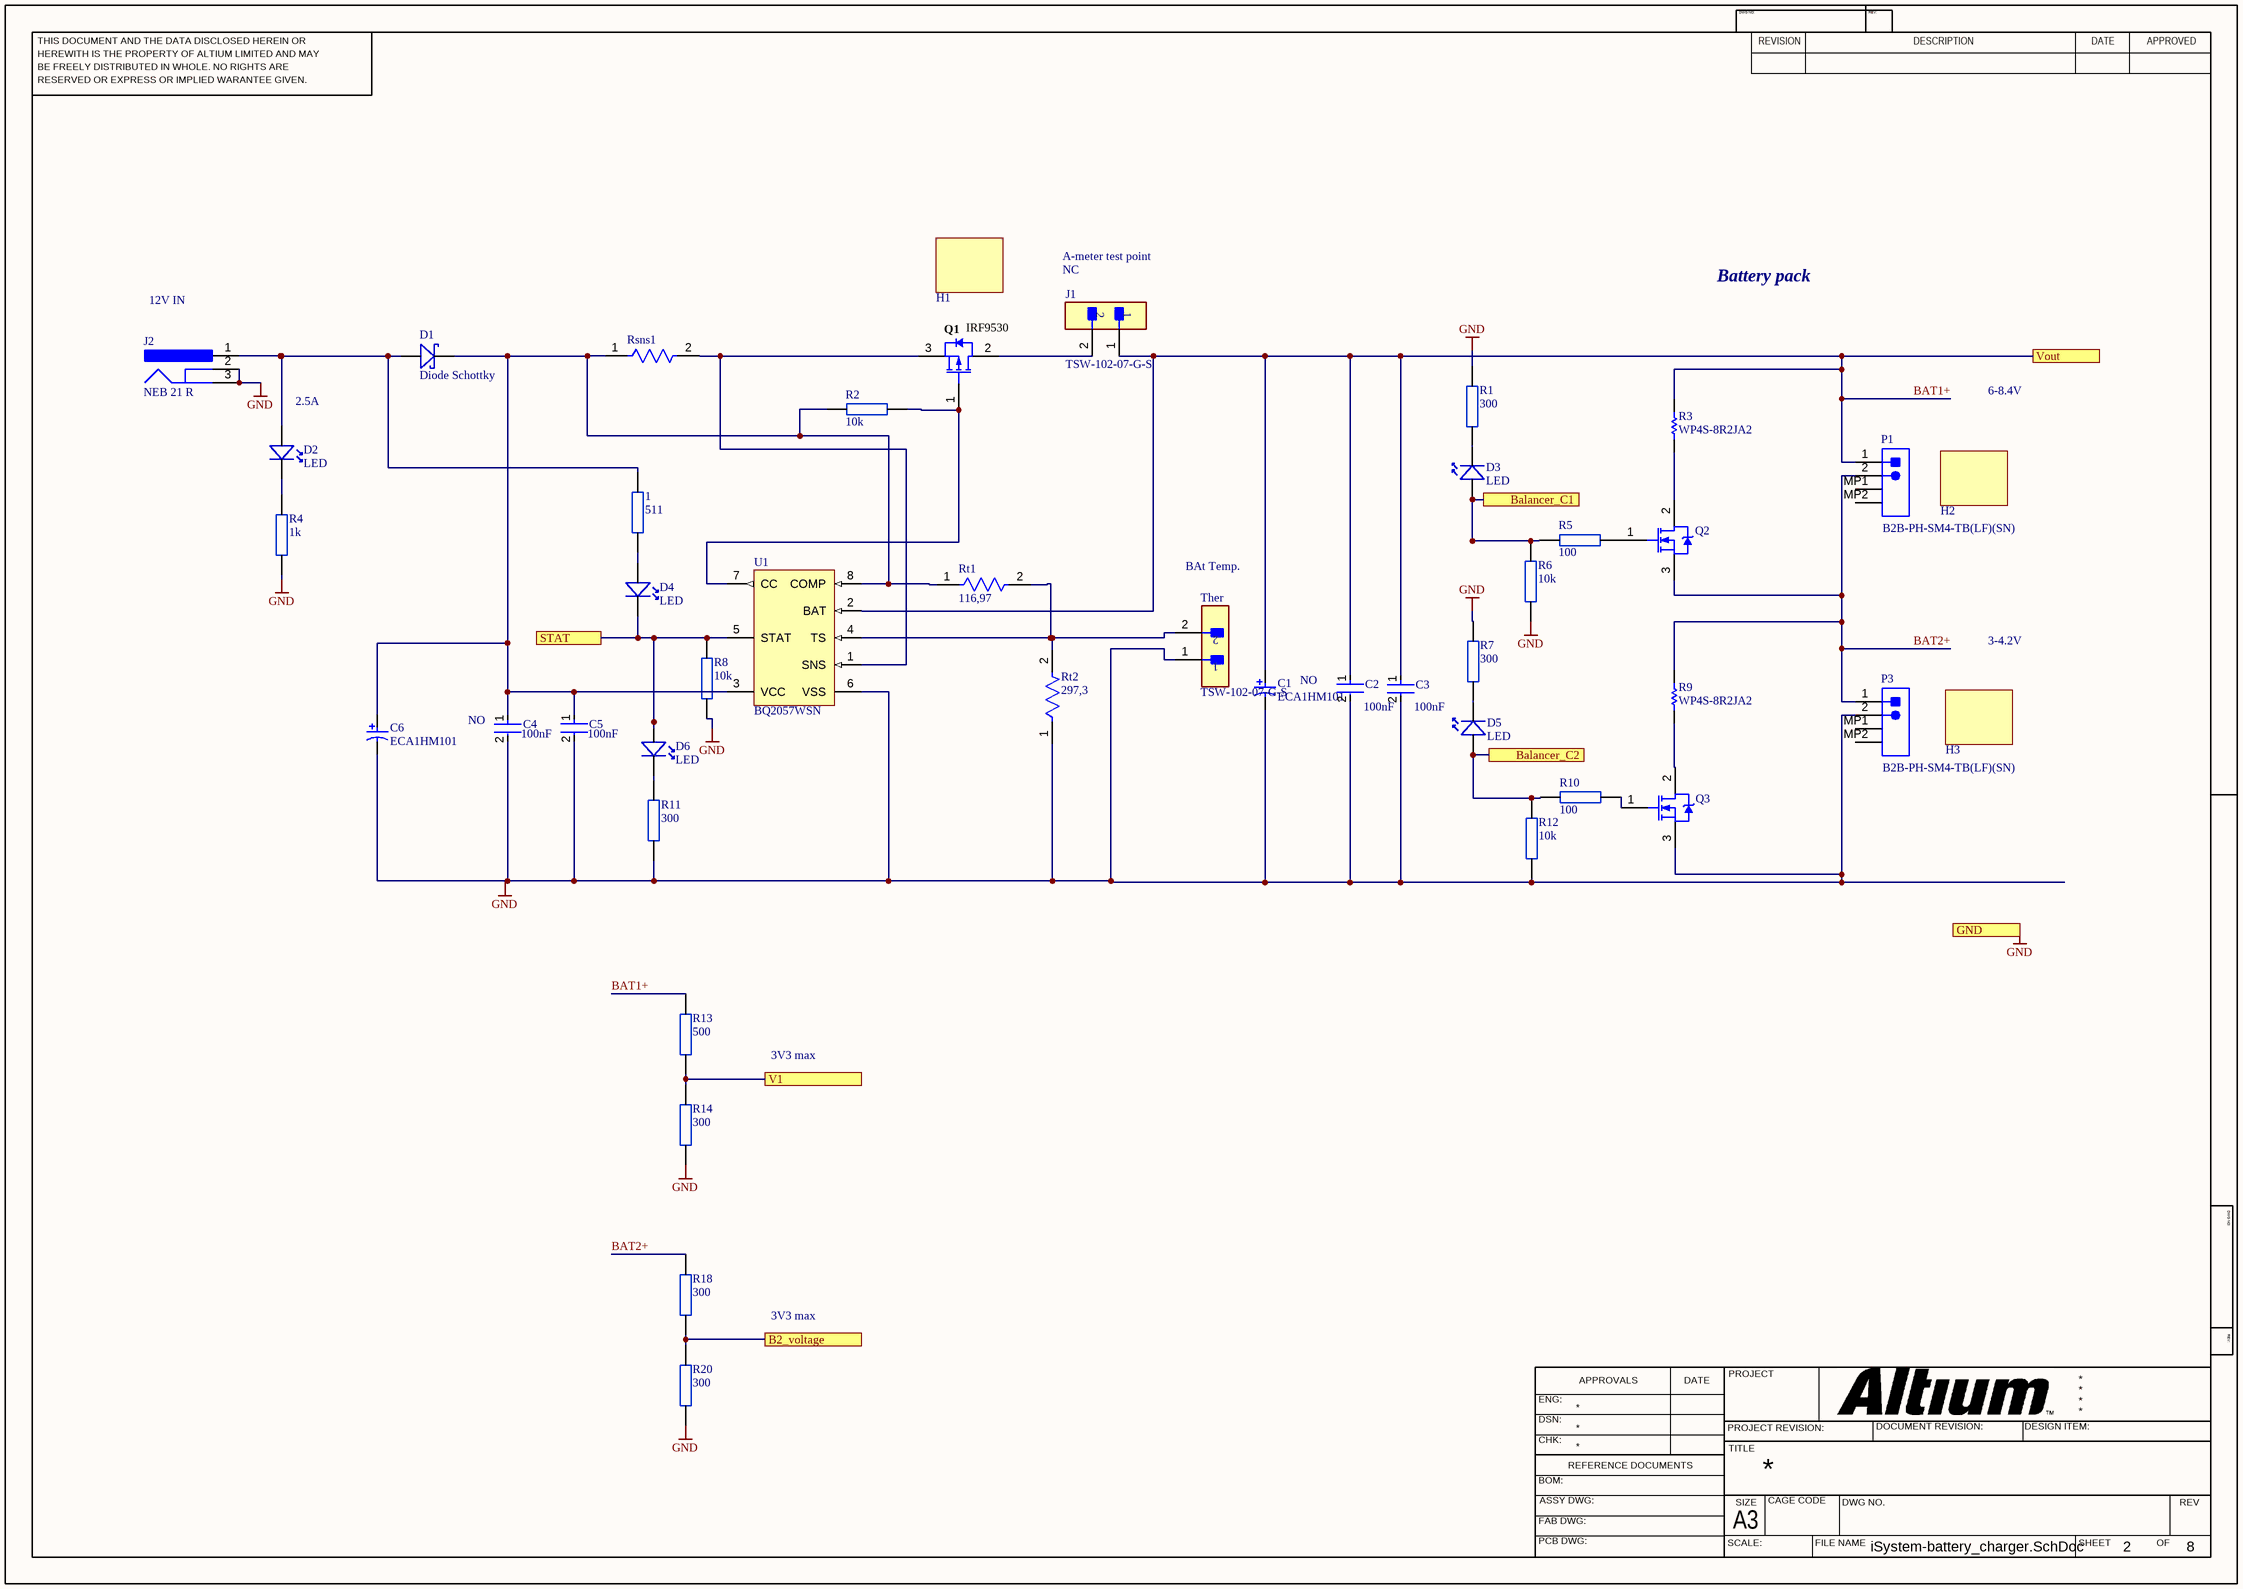
[diagram p7: iSystem-battery_charger.SchDoc]

### Parts
1  511  [0603]
C1  ECA1HM101  [CAPPR65-350-1150X800X1250]
C2  100nF  [FP-CGA3E-0_3-0_1-IPC_A]
C3  100nF  [FP-CGA3E-0_3-0_1-IPC_A]
C4  100nF  [FP-CGA3E-0_3-0_1-IPC_A]
C5  100nF  [FP-CGA3E-0_3-0_1-IPC_A]
C6  ECA1HM101  [CAPPR65-350-1150X800X1250]
D1  Diode Schottky  [DO-214AC SMA]
D2  LED  [0805 LED RED]
D3  LED  [0805 LED RED]
D4  LED  [0805 LED RED]
D5  LED  [0805 LED RED]
D6  LED  [0805 LED RED]
H1  TO-220AB heatsink  [TO-220AB heatsink]  (value not drawn)
H2  TO-220AB heatsink  [TO-220AB heatsink]  (value not drawn)
H3  TO-220AB heatsink  [TO-220AB heatsink]  (value not drawn)
J1  TSW-102-07-G-S  [FP-TSW-102-07-G-S-MFG]
J2  NEB 21 R  [LUMB-NEB21R_V]
P1  B2B-PH-SM4-TB(LF)(SN)  [JST-B2B-PH-SM4-TB-2_V]
P3  B2B-PH-SM4-TB(LF)(SN)  [JST-B2B-PH-SM4-TB-2_V]
Q1  IRF9530  [FAIR-TO-220-3]
Q2  IRFB31N20DPBF  [INTR-TO-220AB-3]  (value not drawn)
Q3  IRFB31N20DPBF  [INTR-TO-220AB-3]  (value not drawn)
R1  300  [0603]
R2  10k  [0603]
R3  WP4S-8R2JA2  [VISH-A1-2_V2]
R4  1k  [0603]
R5  100  [0603]
R6  10k  [0603]
R7  300  [0603]
R8  10k  [0603]
R9  WP4S-8R2JA2  [VISH-A1-2_V2]
R10  100  [0603]
R11  300  [0603]
R12  10k  [0603]
R13  500  [0603]
R14  300  [0603]
R18  300  [0603]
R20  300  [0603]
Rsns1  CRCW12060000Z0EA  [FP-CRCW1206-e3-IPC_C]  (value not drawn)
Rt1  116,97  [FP-CRCW1206-e3-IPC_C]
Rt2  297,3  [FP-CRCW1206-e3-IPC_C]
Ther  TSW-102-07-G-S  [FP-TSW-102-07-G-S-MFG]
U1  BQ2057WSN  [D0008A_N]

### Ports
B2_voltage, Balancer_C1, Balancer_C2, GND, STAT, V1, Vout

### Nets
GND: C1.2 C2.2 C3.2 C4.2 C5.2 C6.2 J2.2 J2.3 P3.2 Q3.3(S) R1.1 R4.1 R6.2 R7.1 R8.1 R11.1 R12.2 R14.1 R20.1 Rt2.1 Ther.1 U1.6(VSS) ; port GND
B1_voltage: R13.1 R14.2 ; port V1
B2_voltage: R18.1 R20.2 ; port B2_voltage
Balancer_C1: D3.1(A) R5.2 R6.1 ; port Balancer_C1
Balancer_C2: D5.1(A) R10.2 R12.1 ; port Balancer_C2
BAT1+: C1.1 C2.1 C3.1 J1.1 P1.1 R3.2 R13.2 U1.2(BAT) ; port Vout
BAT2+: P1.2 P3.1 Q2.3(S) R9.2 R18.2
STAT: D4.2(K) D6.1(A) R8.2 U1.5(STAT) ; port STAT
Net1_1: 1.1 D4.1(A)
Net1_2: 1.2 D1.1(A) D2.1(A) J2.1
NetC4_1: C4.1 C5.1 C6.1 D1.2(K) R2.2 Rsns1.1 Rt1.1 U1.3(VCC) U1.8(COMP)
NetD2_2: D2.2(K) R4.2
NetD3_2: D3.2(K) R1.2
NetD5_2: D5.2(K) R7.2
NetD6_2: D6.2(K) R11.2
NetJ1_2: J1.2 Q1.2(D)
NetQ1_1: Q1.1(G) R2.1 U1.7(CC)
NetQ1_3: Q1.3(S) Rsns1.2 U1.1(SNS)
NetQ2_1: Q2.1(G) R5.1
NetQ2_2: Q2.2(D) R3.1
NetQ3_1: Q3.1(G) R10.1
NetQ3_2: Q3.2(D) R9.1
NetRt1_2: Rt1.2 Rt2.2 Ther.2 U1.4(TS)

Not connected (* = marked no-connect by the designer): P1 MP1 MP2; P3 MP1 MP2

### Notes on the sheet
- A-meter test point
- 12V IN
- NC
- Battery pack
- 6-8.4V
- (near D2) 2.5A
- BAt Temp.
- 3-4.2V
- (near C4) NO
- NO
- 3V3 max
- THIS DOCUMENT AND THE DATA DISCLOSED HEREIN OR
- HEREWITH IS THE PROPERTY OF ALTIUM LIMITED AND MAY
- DWG NO:
- REVISION
- REV:
- DESCRIPTION
- DATE
- APPROVED
- BE FREELY DISTRIBUTED IN WHOLE. NO RIGHTS ARE
- RESERVED OR EXPRESS OR IMPLIED WARANTEE GIVEN.
- ENG:
- APPROVALS
- PROJECT
- DSN:
- CHK:
- REFERENCE DOCUMENTS
- PROJECT REVISION:
- TITLE
- DOCUMENT REVISION:
- DESIGN ITEM:
- BOM:
- FAB DWG:
- PCB DWG:
- ASSY DWG:
- SCALE:
- A3
- SIZE
- CAGE CODE
- FILE NAME
- DWG NO.
- SHEET
- OF
- REV

### Library data of the parts
1 R1 R2 R4-R8 R10-R14 R18 R20 = Resistor: Value: ?
C1 C6 = CMP-1665-00042-2: Aluminum Electrolytic Capacitor, 100 uF, +/- 20%, 50 V, -40 to 85 degC, 2-Pin THD, RoHS, Bulk; Manufacturer: Panasonic; Lead Diameter: 0.6mm; Dielectric Material: Aluminium; Voltage Rating (DC): 50V; Ripple Current (AC): 250mA; Polarity: Polar; Leakage Current: 3uA; Capacitance: 100uF; Life (Hours): 2000Hour; Lead/Base Style: Straight; Dissipation Factor: 0.12%; Radiation Hardening: No; Height: 11.5mm; Package Quantity: 200; Package Reference: CAPPR65-350-1150X800X1250; Min Operating Temperature: -40degC; Mount: ThroughHole; Package Description: 2-Pin Radial Lead, Dia 8 mm, Height 12.5 mm; Case/Package: Radial; Diameter: 8mm; Voltage Rating: 50V; Length: 11.5mm; REACH SVHC: NoSVHC; Height - Seated (Max): 0.492inch; Datasheet URL: https://industrial.panasonic.com/cdbs/www-data/pdf/RDF0000/ABA0000C1218.pdf; RoHSCompliant: true; Ripple Current: 250mA; Lead Free: LeadFree; Voltage: 50V; Manufacturer URL: http://www.panasonic.com/; Number of Pins: 2; Datasheet Version: Rev. 05, 10/2016; Packaging: Bulk; Termination: Radial; Max Operating Temperature: 85degC; Tolerance: 20%; Lead Pitch: 3.5mm
C2-C5 = CMP-2000-07546-2: as C7 on sheet iSystem-jumpers; Weight: 7.1E-05oz; Composition: Ceramic; Max Operating Temperature: 125°C; Termination: SMD/SMT; Dielectric: X7R; Length: 1.6mm; Package Quantity: 1; REACH SVHC: No SVHC; Lead Free: Lead Free; Case Code (Metric): 1608; Min Operating Temperature: -55°C; Packaging: Tape and Reel; Tolerance: 10%; Voltage Rating: 50V; Case Code (Imperial): 0603; Capacitance: 100nF; Case/Package: 0603; Voltage Rating (DC): 50V; Depth: 0.8mm; Radiation Hardening: No; Ratings: AEC-Q200; Mount: Surface Mount; Voltage: 50V; Thickness: 0.035inch; Width: 0.8mm; Height: 0.8mm
J1 Ther = CMP-02766-000084-1: as J6 on sheet iSystem-FDCAN; Package: TSW-102-07-G-S; Digikey Description: CONN HEADER VERT 2POS 2.54MM; ComponentLink2URL: http://suddendocs.samtec.com/catalog_english/tsw_th.pdf; Height: 8.71mm; Temperature: -55°C to +125°C; Device Class L2: Headers and Wire Housings; ComponentLink2Description: Datasheet; Device Class L3: unset; Contact Material: Gold,Nickel; Temperature Range Low: -55°C; Temperature Range High: +125°C; RoHS: TRUE; Device Class L1: Connectors; Mouser Description: Conn Unshrouded Header HDR 2 POS 2.54mm Solder ST Thru-Hole Automotive Bulk; Number Of Rows: 1; Category: Conn; Pitch: 2.54mm; Lead Free: Yes; Automotive: No; Manufacturer Part Number: TSW-102-07-G-S; Footprint Url: http://suddendocs.samtec.com/prints/tsw-xxx-xx-x-x-xx-xxx-footprint.pdf; Octopart: https://octopart.com/tsw-102-07-g-s-samtec-272197
J2 = CMP-2000-06841-1: Jack Socket, Body 14.5 x 9 mm, Height 11 mm, -20 to 70 degC, 3-Pin THD, RoHS, Bulk; Manufacturer: Lumberg; Body Orientation: RightAngle; Voltage Rating: 12Vdc; Current Rating: 3A; Maximum Operating Temperature: +70°C; Mounting Technology: ThroughHole; Termination Method: Solder; Package Description: 3-Pin Through Hole Device, Body 14.5 x 9 mm, Height 11 mm; Datasheet URL: https://datasheet.ciiva.com/11720/0900766b805694d6-11720273.pdf; Datasheet Version: 12/2004; Package Reference: NEB21R; Manufacturer URL: http://www.lumberg.com/; Plug/Socket: Socket; Mounting Type: ThroughHole; Minimum Operating Temperature: -20°C
P1 P3 = CMP-2000-05163-1: Male Header, Pitch 2 mm, 1 x 2 Position, Height 6.6 mm, RoHS, Tape and Reel; Manufacturer: JST; No of Positions: 2; Style/Orientation: StraightHeader/Plug; Pitch: 2mm; Datasheet URL: https://ciiva.com/datasheet-click-26894756?src=ciiva&sig=90099765; Termination: Crimp; Manufacturer URL: http://www.jst.com/home2.html; Type: ShroudedHeader; Datasheet Version: Dec-12
Q1 = CMP-2000-04936-1: P-Channel QFET(R) MOSFET, -60 V, -27 A, -55 to 175 degC, 3-Pin TO-220, RoHS, Tube; Manufacturer: Fairchild; Rated Power Dissipation: 120W; Qg Gate Charge: 33nC; Drain-Source On Resistance-Max: 0.07O; Drain-to-Source Voltage [Vdss]: 60V; Package Reference: TO-220; Datasheet URL: https://www.fairchildsemi.com/datasheets/FQ/FQP27P06.pdf; Datasheet Version: Mar-13; Package Description: 3-Pin Through Hole Device, Body 10 x 4.5 mm, Pitch 2.54 mm; Package URL: https://www.fairchildsemi.com/package-drawings/TO/TO220B03.pdf; Channel Type: P-Channel; Manufacturer URL: https://www.fairchildsemi.com/
Q2 Q3 = CMP-2000-06468-1: HEXFET(R) Power MOSFET, 200 V, 31 A, 82 mOhm, -55 to 175 degC, 3-Pin FM (TO-220AB), RoHS, Tube; Manufacturer: International Rectifier; Temperature, Operating, Maximum: +175°C; Channel Mode: Enhancement; Power Dissipation: 200W; Time, Turn-Off Delay: 26ns; Voltage, Gate to Source: ±30V; Capacitance, Input: 2370pF@25V; Gate Charge, Total: 70nC; Brand/Series: HEXFET®Series; Voltage, Diode Forward: 1.3V; Polarization: N-Channel; Transconductance, Forward: 17S; Resistance, Thermal, Junction to Case: 0.75°C/W; Current, Drain: 31A; Time, Turn-On Delay: 16ns; Configuration: DualDrain; Resistance, Drain to Source On: 0.082Ω; Channel Type: N; Temperature, Operating, Minimum: -55°C; Number of Elements per Chip: 1; Temperature, Operating, Range: -55to+175°C; Voltage, Drain to Source: 200V; Typical Gate Charge @ Vgs: 70nC@10V; Package Description: 3-Pin Flange Mount, Body 4.445 x 10.415 mm, Pitch 2.54 mm; Length: 10.54mm; Mounting Technology: ThroughHole; Height: 8.77mm; Width: 4.69mm; Datasheet Version: 01/2004; Mounting Type: ThroughHole; Voltage, Forward, Diode: 1.3V; Datasheet URL: http://www.infineon.com/dgdl/irfb31n20dpbf.pdf?fileId=5546d462533600a40153561547951df1; Package Type: TO-220AB; Number of Pins: 3; Package Reference: TO-220AB; Dimensions: 10.54x4.69x8.77mm; Manufacturer URL: http://internationalrectifier.com/; Voltage, Breakdown, Drain to Source: 200V
R3 R9 = CMP-1240-00001-1: Power Metal Film Leaded Resistor, 62 KOhm +/-5%, 2 W, 2-Pin THD, RoHS, Ammo Pack; PartNumber: PR02000206202JA100; Manufacturer: Vishay Semiconductor; Resistance: 62 KOhm; Temperature Coefficient: +/-250 ppm/degC; Power: 2 W; ComponentLink2URL: http://www.vishay.com/docs/28729/28729.pdf; Mounting Technology: Through Hole; Tolerance: +/-5%; ComponentLink3Description: Package Specification; ComponentLink3URL: http://www.vishay.com/docs/28729/28729.pdf; ComponentLink1Description: Manufacturer URL; ComponentLink2Description: Datasheet; DatasheetVersion: Jun-13; PackageDescription: 2-Pin Axial Lead, Body 10 x 3.9 mm; ComponentLink1URL: http://www.vishay.com/; Packing: Ammo Pack; RoHS: TRUE
Rsns1 Rt1 Rt2 = CMP-2003-04857-2: RES Thick Film, 0Ω, 0.25W, 1206; Resistance: 0mR; Power Rating: 250mW; Temperature Coefficient: 100ppm/°C; Tolerance: 1%; Voltage Rating (DC): 200V; Width: 1.6mm; Termination: SMD/SMT; Contact Plating: Tin; Min Operating Temperature: -55°C; Military Standard: Not; Mount: Surface Mount; Case Code (Metric): 3216; Case Code (Imperial): 1206; Packaging: Tape and Reel; Depth: 1.6mm; Case/Package: 1206; Radiation Hardening: No; Height: 0.55mm; Package Quantity: 5000; Weight: 0.000353oz; Max Operating Temperature: 155°C; Length: 3.2mm; Composition: Thick Film; Lead Free: Lead Free; Voltage Rating: 200V
U1 = CMP-0321-00344-2: Low Dropout Linear 2-Cell Li-Ion Charge Controller with AutoCompTM, 8.4 V, 4.5 V, -20 to 70 degC, 8-pin SOIC (D), Green (RoHS & no Sb/Br); Manufacturer: Texas Instruments; Over Voltage Protection: N; SubFamily: Battery Charge Management; Vin(Min)(V): 4.5; Li-Polymer: Y; Mounting Technology: Surface Mount; PackageDescription: 8-Pin Plastic Small Outline Integrated Circuit, 4.9 x 3.9 mm, Pitch 1.27 mm Pitch; NiCd: N; ComponentLink1Description: Datasheet; PackageVersion: revM, Jun-2011; Eco-Plan: Green (RoHS & no Sb/Br); ComponentLink1URL: http://www.ti.com/general/docs/lit/getliterature.tsp?genericPartNumber=BQ2057W&fileType=pdf; NiMH: N; Code_JEDEC: MS-012AA; Lead Acid: N; PackageReference: D0008A; PartNumber: BQ2057WSN; Li-Ion: Y; DatasheetVersion: SLUS025F

## Nets that join several sheets
3V3: iSystem-boards (B1.4 E1.1 J9.1 P15.1), iSystem-arduino_connector (P7.4 P8.4)
5V: iSystem-boards (LS1.1), iSystem-jumpers (14 pins), iSystem-arduino_connector (P7.5 P8.5)
GND: iSystem-boards (5 pins), iSystem-jumpers (C7.2 C8.2 U2.4), iSystem-arduino_connector (9 pins), iSystem-battery_charger (22 pins)
B1_voltage: iSystem-arduino_connector (P11.6 P12.6), iSystem-battery_charger (R13.1 R14.2)
B2_voltage: iSystem-arduino_connector (P11.5 P12.5), iSystem-battery_charger (R18.1 R20.2)
Balancer_C1: iSystem-arduino_connector (P9.6 P10.6), iSystem-battery_charger (D3.1 R5.2 R6.1)
Balancer_C2: iSystem-arduino_connector (P9.5 P10.5), iSystem-battery_charger (D5.1 R10.2 R12.1)
BAT1+: iSystem-jumpers (SW1.2), iSystem-battery_charger (8 pins)
buzzer: iSystem-boards (R19.2), iSystem-arduino_connector (P5.10 P6.10)
RX_GSM: iSystem-boards (B1.3), iSystem-arduino_connector (P9.7 P10.7)
RX_XBEE: iSystem-boards (E1.3 P15.3), iSystem-ST_MOD (J5.17)
SCL: iSystem-boards (J8.1), iSystem-arduino_connector (P5.1 P6.1)
SDA: iSystem-boards (J8.2), iSystem-arduino_connector (P5.2 P6.2)
STAT: iSystem-arduino_connector (P9.4 P10.4), iSystem-battery_charger (D4.2 D6.1 R8.2 U1.5)
TX_GSM: iSystem-boards (B1.2), iSystem-arduino_connector (P9.8 P10.8)
TX_XBEE: iSystem-boards (E1.2 P15.2), iSystem-ST_MOD (J5.15)